# EAGLE design ledbrd (EAGLE 5.11)
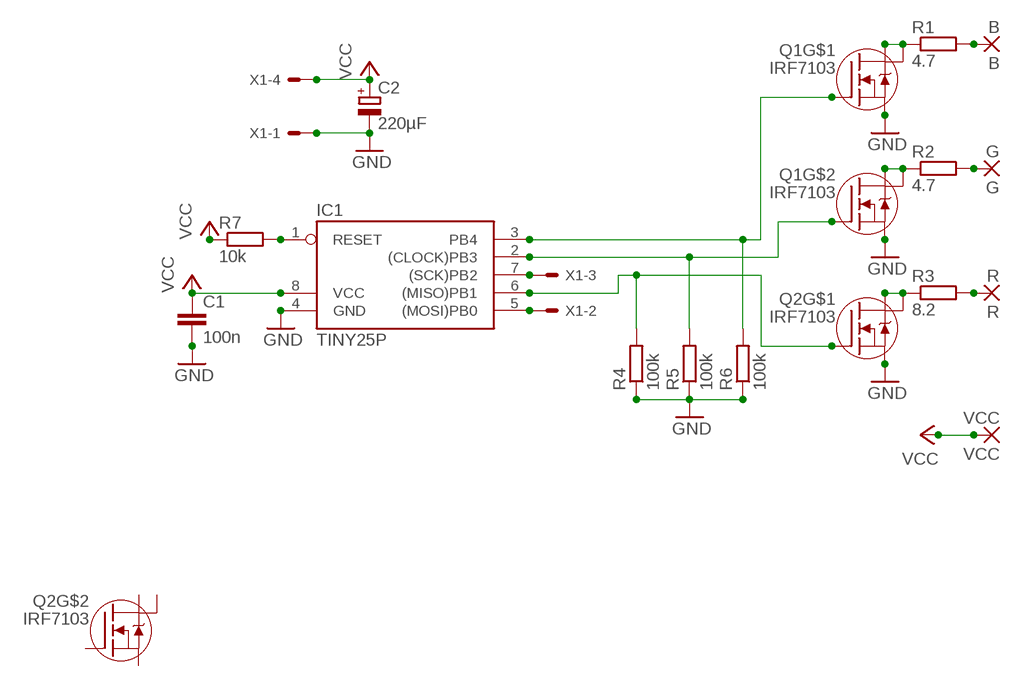
[diagram p0: schematic, sheet 1]

## Parts
B  B  WIREPAD2,54/1,1  [2,54/1,1]
C1  100n  C-EUC1206  [C1206]
C2  220µF  CPOL-EU153CLV-0605  [153CLV-0605]
G  G  WIREPAD2,54/1,1  [2,54/1,1]
IC1  TINY25P  TINY22P  [DIL08]
Q1  IRF7103  [SO8-2]
Q2  IRF7103  [SO8-2]
R  R  WIREPAD2,54/1,1  [2,54/1,1]
R1  4.7  R-EU_0414/5V  [0414V]
R2  4.7  R-EU_0414/5V  [0414V]
R3  8.2  R-EU_0414/5V  [0414V]
R4  100k  R-EU_R1206  [R1206]
R5  100k  R-EU_R1206  [R1206]
R6  100k  R-EU_R1206  [R1206]
R7  10k  R-EU_R1206  [R1206]
VCC  VCC  WIREPAD2,54/1,1  [2,54/1,1]
X1  22-23-2041  [22-23-2041]

## Nets
GND: C1.2 C2.- IC1.4(GND) Q1.1(S) Q1.3(S) Q2.1(S) R4.1 R5.1 R6.1 X1.1
N$1: IC1.1(RESET) R7.2
N$2: Q1.5(D) Q1.6(D) R2.1
N$3: IC1.5((MOSI)PB0) X1.2
N$4: IC1.7((SCK)PB2) X1.3
N$5: IC1.6((MISO)PB1) Q2.2(G) R4.2
N$6: IC1.2((CLOCK)PB3) Q1.4(G) R5.2
N$7: IC1.3(PB4) Q1.2(G) R6.2
N$8: G.1(P) R2.2
N$9: Q1.7(D) Q1.8(D) R1.1
N$10: B.1(P) R1.2
N$11: Q2.7(D) Q2.8(D) R3.1
N$12: R3.2 R.1(P)
VCC: C1.1 C2.+ IC1.8(VCC) R7.1 VCC.1(P) X1.4
Unconnected: Q2.3(S) Q2.4(G) Q2.5(D) Q2.6(D)

## Library data of the parts
B G R VCC = wirepad:WIREPAD: Wire PAD connect wire on PCB
C1 = rcl:C-EU: CAPACITOR, European symbol
C2 = rcl:CPOL-EU: POLARIZED CAPACITOR, European symbol
IC1 = atmel:TINY22: MICROCONTROLLER 1K ROM 128 bytes RAM 128 bytes EEPROM; OC_FARNELL: unknown; OC_NEWARK: unknown
Q1 Q2 = irf-2:IRF7103: HEXFET® Power MOSFET Adavanced Process Technology Ultra Low On-Resistance Dual N-Channel MOSFET Surface Mount Available in Tape & Reel Dynamic dv/dt Rating Fast Switching Please connect both Drain-Pins of each FET for thermal Reasons! (Pin 5 with Pin 6, 7 with 8)
R1-R7 = rcl:R-EU_: RESISTOR, European symbol
X1 = con-molex:22-23-2041: .100" (2.54mm) Center Header - 4 Pin; MF: MOLEX; MPN: 22-23-2041; OC_FARNELL: 1462920; OC_NEWARK: 38C0355

## Board
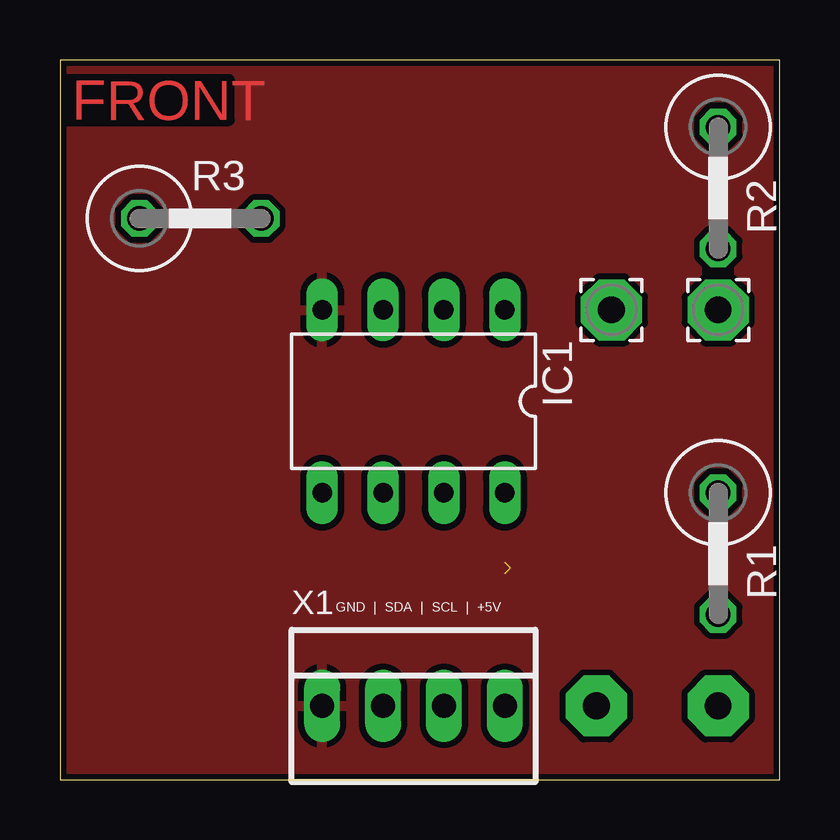
[diagram p1: board, top side]
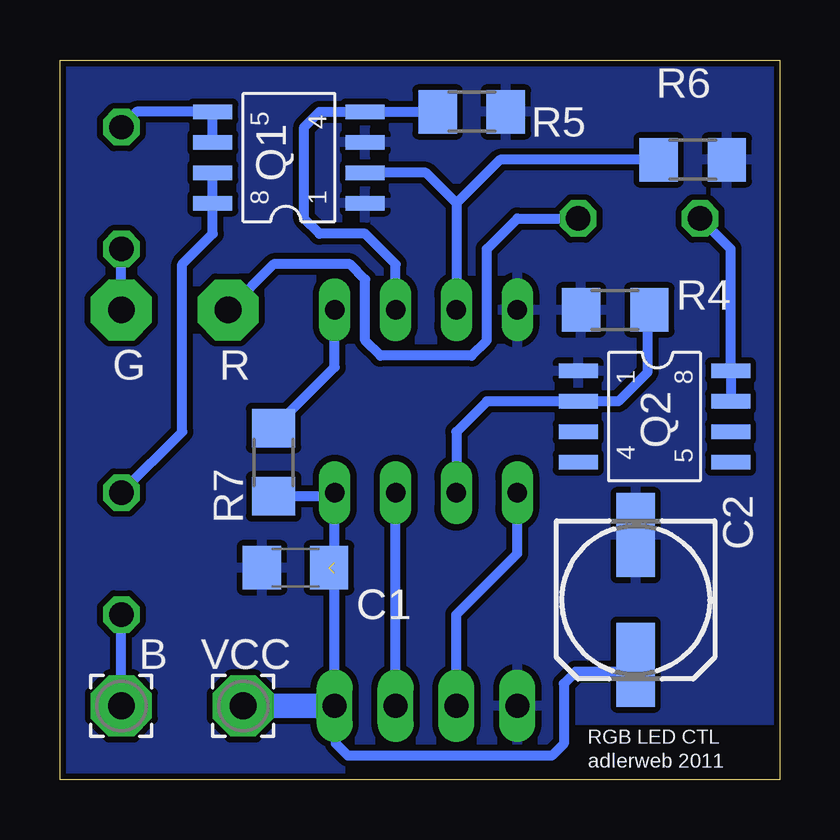
[diagram p2: board, bottom side, seen from below]

Size 30 x 30.01 mm. Coordinates in mm from the lower left corner, seen from the top.
Outline: 0,0 30,0 30,30.01 0,30.01 0,0
Copper layers (1*16): Top 0.035mm / dielectric 1.5mm / Bottom 0.035mm
Design rules "Fusion_eagle_rule_v1.1": minimum track width 6mil, minimum drill 12mil, track to track 6mil, track to pad 6mil, pad to pad 6mil, via to via 6mil, smd to smd 0mil, copper to edge 10mil, drill to drill 10mil, minimum pad ring 10mil, minimum via ring 6mil, stop-mask expansion 2mil, vias tented up to drill 100mil, thermal gap 10mil

### Footprints (pad centres in the part's own frame; a part is rotated, then mirrored left to right if it is on the bottom)
2,54/1,1 = drill 1.118 pad 2.54 octagon: 1 0,0
C1206 = smd 1.6 x 1.8: 1 -1.4,0; 2 1.4,0
153CLV-0605 = smd 3.5 x 1.6: + 2.7,0; - -2.7,0
DIL08 = drill 0.813 long: 1 -3.81,-3.81; 2 -1.27,-3.81; 3 1.27,-3.81; 4 3.81,-3.81; 5 3.81,3.81; 6 1.27,3.81; 7 -1.27,3.81; 8 -3.81,3.81
SO8-2 = smd 0.61 x 1.626: 1 -2.54,-2.54; 2 -1.27,-2.54; 3 0,-2.54; 4 1.27,-2.54; 5 1.27,3.81; 6 0,3.81; 7 -1.27,3.81; 8 -2.54,3.81
0414V = drill 1.016 octagon: 1 -2.54,0; 2 2.54,0
R1206 = smd 1.6 x 1.803: 1 -1.422,0; 2 1.422,0
22-23-2041 = drill 1 long: 1 -3.81,0; 2 -1.27,0; 3 1.27,0; 4 3.81,0

### Placement (x,y rotation side)
B  27.44,3.08 0 bottom
C1  20.18,8.84 180 bottom
C2  6,7.5 270 bottom
G  27.44,19.59 0 top
IC1  14.74,15.78 180 top
Q1  19.82,26.57 90 bottom
Q2  5.85,14.51 270 bottom
R  23,19.59 0 top
R1  27.44,9.43 270 top
R2  27.44,24.67 270 top
R3  5.85,23.4 0 top
R4  6.85,19.59 0 bottom
R5  12.84,27.84 180 bottom
R6  3.62,25.84 180 bottom
R7  21.09,13.24 90 bottom
VCC  22.36,3.08 0 bottom
X1  14.74,3.08 0 top

### Tracks (layer width: path | path; a pad name or v marks a point on that pad's centre or on a via)
GND
  pour Bottom (isolate 0.254): -0.5,30.5 30.5,30.5 30.5,-0.5 8.5,-0.5 8.5,2.5 -0.5,2.5
  pour Top (isolate 0.254): -1,36 34,36 34,-2.5 -1,-2.5
N$1
  Bottom 0.406: IC1.1 18.55,17.2 R7.2
N$2
  Bottom 0.406: Q1.6 Q1.5 26.8,27.84 R2.1
N$3
  Bottom 0.406: IC1.5 10.93,9.43 13.47,6.89 X1.2
N$4
  Bottom 0.406: X1.3 IC1.7
N$5
  Bottom 0.406: IC1.6 13.47,14.51 12.2,15.78 Q2.2 6.72,15.78 5.5,17 5.5,19.52 R4.2
N$6
  Bottom 0.406: R5.2 Q1.4 19.18,27.84 19.82,27.21 19.82,23.4 19.18,22.77 17.28,22.77 16.01,21.5 IC1.2
N$7
  Bottom 0.406: 13.47,24.04 IC1.3 | 13.47,24.04 14.74,25.3 Q1.2 | 13.47,24.04 13.46,24.04 11.65,25.84 R6.2
N$8
  Bottom 0.406: G.1 R2.2
N$9
  Bottom 0.406: Q1.7 Q1.8 23.63,22.77 24.9,21.5 24.9,14.51 R1.1
N$10
  Bottom 0.406: B.1 R1.2
N$11
  Bottom 0.406: Q2.7 Q2.8 2.04,22.13 R3.1
N$12
  Bottom 0.406: R3.2 10.93,23.4 12.2,22.13 12.2,18.32 12.84,17.68 16.64,17.68 17.28,18.32 17.28,20.86 17.91,21.5 21.09,21.5 R.1
VCC  (2 unrouted)
  Bottom 0.406: 18.55,9.07 IC1.8 18.7,11.82 R7.1 | 18.55,8.61 X1.4 18.5,3.03 18.5,1.5 18,1 9.5,1 9,1.5 9,4 8.5,4.5 6.3,4.5 C2.+
  Bottom 1.016: X1.4 VCC.1

### Text on the board
Top: FRONT
tNames: GND | SDA | SCL | +5V
bNames: RGB LED CTL | adlerweb 2011
bValues: 0.2.2